# EasyEDA schematic Schematic Diagram.json
TITLE: Smart Gas Leakage Detector; REV: 1.0; Date: 2020-04-10; Sheet: 1/1; Drawn By: MTD; Company: EE356-G5
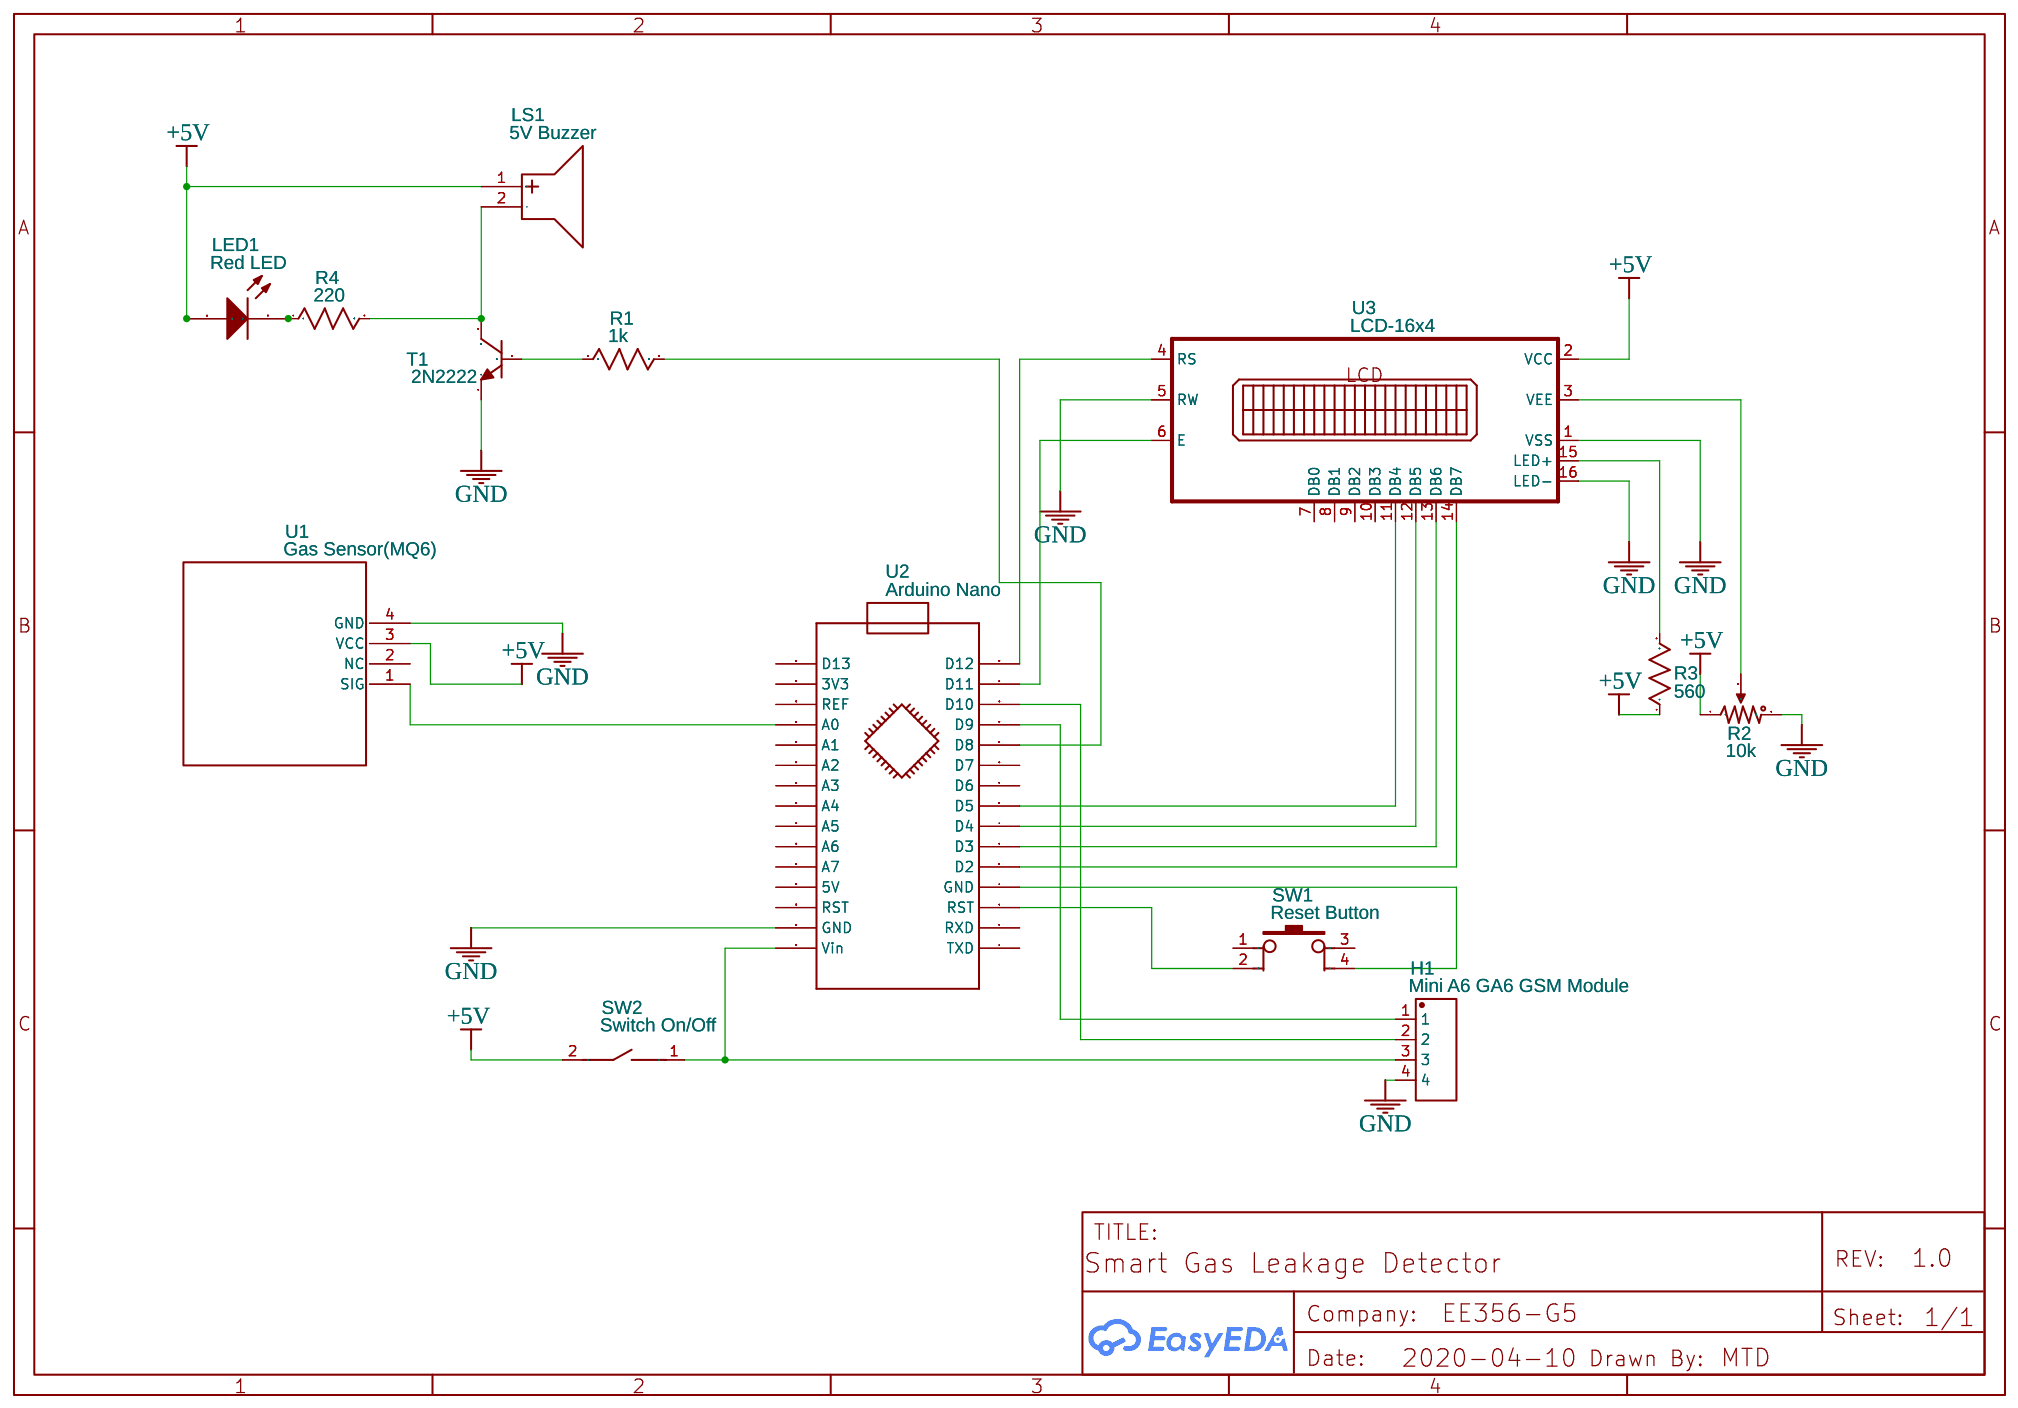
[diagram p0: schematic sheet]

## Parts
H1  Mini A6 GA6 GSM Module  [HDR-TH_4P-P2.54-V]
LED1  Red LED  [F5RED LED]
LS1  5V Buzzer  [BUZZER-TH_2PIN_GMD9505RB-3V2700]
R1  1k  [AXIAL-0.3]
R2  10k  [RES-ADJ_3386P]
R3  560  [AXIAL-0.3]
R4  220  [AXIAL-0.3]
SW1  Reset Button  [SW-SMD_4PIN-L6.00-W6.00]
SW2  Switch On/Off  [SW-TH_2PIN-L6.60-W6.60]
T1  2N2222  [TO-92(TO-92-3)]
U1  Gas Sensor(MQ6)  [GROVE - GAS SENSOR(MQ5)]
U2  Arduino Nano  [ARDUINO_NANO]
U3  LCD-16x4  [DMC1602B]

## Library data of the parts
H1 = -: Supplier: LCSC; Manufacturer: ReliaPro; Manufacturer Part: Headers  Pins 1*4P; image: http://image.lceda.cn/szlcsc/C59481.jpg; Supplier Part: C59481
LED1 = F5Red LED: Supplier: LCSC; Manufacturer: ReliaPro; Supplier Part: C10500
LS1 = -: Supplier: LCSC; Supplier Part: C252935; Manufacturer: INGHAi; Manufacturer Part: GMD9505RB-3V2700; Contributor: LCSC
R1 R3 R4 = Res_AXIAL-0.3(1/8W)_US
R2 = Potentiometer: K(%): 50
SW1 = Button-SMD-6×6×5mm: Supplier: LCSC; Manufacturer: ReliaPro; Manufacturer Part: 6×6×5mm RHOS; image: //image.lceda.cn/szlcsc/C21456.jpg; Supplier Part: C21456
SW2 = SWITCH,6*6*5PLASTIC HEAD,260G, 0.25MM,DIP2: Supplier: LCSC; Manufacturer: BBJ; Manufacturer Part: Switch,6*6*5Plastic head,260G, 0.25mm,DIP2; Contributor: LCSC; Supplier Part: C71845
T1 = -: Supplier: LCSC; Manufacturer: SEMTECH; Manufacturer Part: 2N3904; Supplier Part: C118538
U1 = -: sourceId: yfdbxveAk; Supplier Part: undefined; Supplier: SeeedStudio
U2 = -: catid: 20; sourceId: g2wyehQ7j; Manufacturer Part: ?

## Nets
+5V: LED1.3(A) LED1.4(A) LS1.1(+) R2.1 R3.1 SW2.2 U1.3(VCC) U3.2(VCC)
GND: H1.4 R2.3(2) T1.1(E) U1.4(GND) U2.29(GND) U3.1(VSS) U3.5(RW) U3.16(LED-)
Net-(H1-1): H1.1 U2.12(A4)
Net-(H1-2): H1.2 U2.13(D10)
Net-(H1-3): H1.3 SW2.1 U2.30(Vin)
Net-(LED1-1): LED1.1(k) LED1.2(K) R4.1
Net-(LS1-2): LS1.2(-) R4.2 T1.3(C)
Net-(R1-1): R1.1 T1.2(B)
Net-(R1-2): R1.2 U2.11(D8)
Net-(R2-2): R2.2(3) U3.3(VEE)
Net-(R3-2): R3.2 U3.15(LED+)
Net-(SW1-2): SW1.2 U2.3(RST)
Net-(SW1-4): SW1.4 U2.4(GND)
Net-(U1-1): U1.1(SIG) U2.19(A0)
Net-(U2-5): U2.5(D2) U3.14(DB7)
Net-(U2-6): U2.6(D3) U3.13(DB6)
Net-(U2-7): U2.7(D4) U3.12(DB5)
Net-(U2-8): U2.8(D5) U3.11(DB4)
Net-(U2-14): U2.14(A5) U3.6(E)
Net-(U2-15): U2.15(D12) U3.4(RS)

Not connected (* = marked no-connect by the designer): SW1 1 3; U1 2(NC); U2 1(TXD) 2(RXD) 9(D6) 10(D7) 16(D13) 17(3V3) 18(REF) 20(A1) 21(A2) 22(A3) 25(A6) 26(A7) 27(5V) 28(RST); U3 7(DB0) 8(DB1) 9(DB2) 10(DB3)
